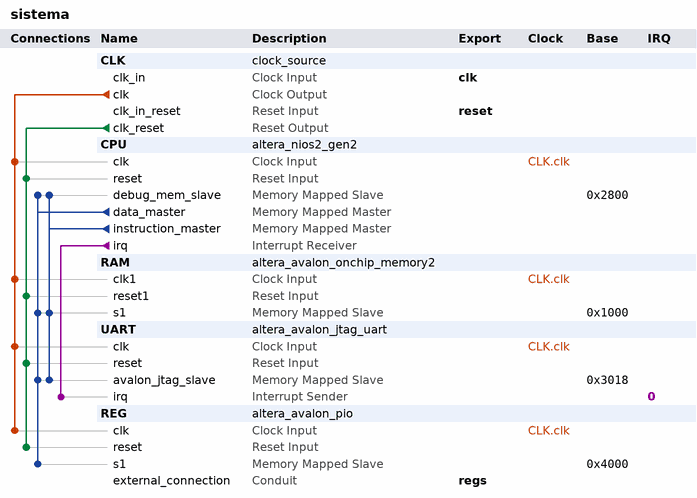
[diagram p0: system contents]
# Platform Designer (Qsys) system sistema, Cyclone V 5CEBA2F17A7
# Parameters at their usual value, and those the tool derives, are not listed.
package require -exact qsys 20.1
create_system sistema
set_project_property DEVICE_FAMILY {Cyclone V}
set_project_property DEVICE 5CEBA2F17A7

add_instance CLK clock_source 20.1
set_instance_parameter_value CLK clockFrequency 50000000

add_instance CPU altera_nios2_gen2 20.1
set_instance_parameter_value CPU dcache_size 2048
set_instance_parameter_value CPU exceptionSlave RAM.s1
set_instance_parameter_value CPU icache_size 4096
set_instance_parameter_value CPU impl Tiny
set_instance_parameter_value CPU resetSlave RAM.s1

add_instance RAM altera_avalon_onchip_memory2 20.1
set_instance_parameter_value RAM dataWidth 32
set_instance_parameter_value RAM dualPort false
set_instance_parameter_value RAM initMemContent true
set_instance_parameter_value RAM initializationFileName onchip_mem.hex
set_instance_parameter_value RAM memorySize 4096

add_instance UART altera_avalon_jtag_uart 20.1
set_instance_parameter_value UART simInteractiveOptions NO_INTERACTIVE_WINDOWS

add_instance REG altera_avalon_pio 20.1
set_instance_parameter_value REG direction Output
set_instance_parameter_value REG width 8

# connections
add_connection CLK.clk CPU.clk clock
add_connection CLK.clk RAM.clk1 clock
add_connection CLK.clk REG.clk clock
add_connection CLK.clk UART.clk clock
add_connection CLK.clk_reset CPU.reset reset
add_connection CLK.clk_reset RAM.reset1 reset
add_connection CLK.clk_reset REG.reset reset
add_connection CLK.clk_reset UART.reset reset
add_connection CPU.data_master CPU.debug_mem_slave avalon
set_connection_parameter_value CPU.data_master/CPU.debug_mem_slave baseAddress 0x2800
add_connection CPU.data_master RAM.s1 avalon
set_connection_parameter_value CPU.data_master/RAM.s1 baseAddress 0x1000
add_connection CPU.data_master REG.s1 avalon
set_connection_parameter_value CPU.data_master/REG.s1 baseAddress 0x4000
add_connection CPU.data_master UART.avalon_jtag_slave avalon
set_connection_parameter_value CPU.data_master/UART.avalon_jtag_slave baseAddress 0x3018
add_connection CPU.instruction_master CPU.debug_mem_slave avalon
set_connection_parameter_value CPU.instruction_master/CPU.debug_mem_slave baseAddress 0x2800
add_connection CPU.instruction_master RAM.s1 avalon
set_connection_parameter_value CPU.instruction_master/RAM.s1 baseAddress 0x1000
add_connection CPU.instruction_master UART.avalon_jtag_slave avalon
set_connection_parameter_value CPU.instruction_master/UART.avalon_jtag_slave baseAddress 0x3018
add_connection CPU.irq UART.irq interrupt
set_connection_parameter_value CPU.irq/UART.irq irqNumber 0

# exported interfaces
add_interface clk clock sink
set_interface_property clk EXPORT_OF CLK.clk_in
add_interface regs conduit end
set_interface_property regs EXPORT_OF REG.external_connection
add_interface reset reset sink
set_interface_property reset EXPORT_OF CLK.clk_in_reset

set_interconnect_requirement {$system} qsys_mm.clockCrossingAdapter HANDSHAKE
set_interconnect_requirement {$system} qsys_mm.enableEccProtection FALSE
set_interconnect_requirement {$system} qsys_mm.insertDefaultSlave FALSE
set_interconnect_requirement {$system} qsys_mm.maxAdditionalLatency 1

save_system sistema.qsys
